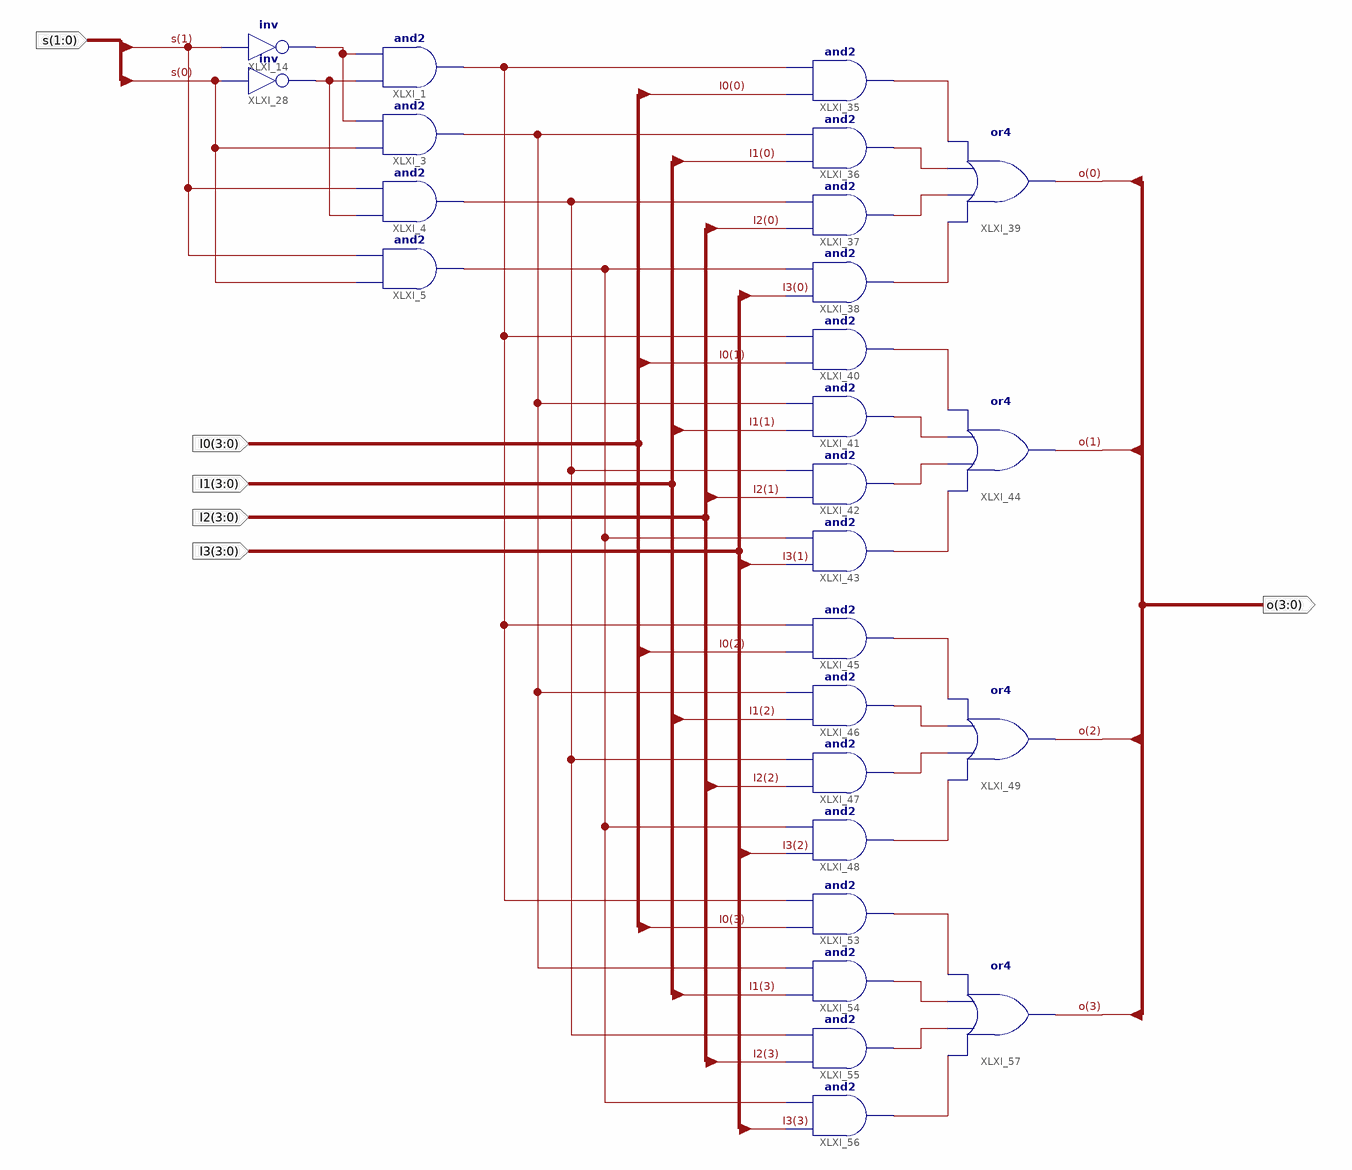
[diagram p0: schematic sheet 1]
// Xilinx ISE schematic MUX4T1_4.sch (kintex7) as structural Verilog: 26 symbols, 6 ports
module MUX4T1_4 (
  input  [1:0] s,
  input  [3:0] I0,
  input  [3:0] I2,
  input  [3:0] I3,
  input  [3:0] I1,
  output [3:0] o
);

  wire XLXN_21, XLXN_22, XLXN_30, XLXN_31, XLXN_32, XLXN_33, XLXN_39, XLXN_40, XLXN_41, XLXN_42, XLXN_43,
       XLXN_44, XLXN_45, XLXN_46, XLXN_47, XLXN_48, XLXN_49, XLXN_50, XLXN_51, XLXN_52, XLXN_53, XLXN_54;

  and XLXI_1 (XLXN_30, XLXN_21, XLXN_22);
  and XLXI_3 (XLXN_31, s[0], XLXN_22);
  and XLXI_4 (XLXN_32, XLXN_21, s[1]);
  and XLXI_5 (XLXN_33, s[0], s[1]);
  not XLXI_14 (XLXN_22, s[1]);
  not XLXI_28 (XLXN_21, s[0]);
  and XLXI_35 (XLXN_39, I0[0], XLXN_30);
  and XLXI_36 (XLXN_40, I1[0], XLXN_31);
  and XLXI_37 (XLXN_41, I2[0], XLXN_32);
  and XLXI_38 (XLXN_42, I3[0], XLXN_33);
  or XLXI_39 (o[0], XLXN_42, XLXN_41, XLXN_40, XLXN_39);
  and XLXI_40 (XLXN_43, I0[1], XLXN_30);
  and XLXI_41 (XLXN_44, I1[1], XLXN_31);
  and XLXI_42 (XLXN_45, I2[1], XLXN_32);
  and XLXI_43 (XLXN_46, I3[1], XLXN_33);
  or XLXI_44 (o[1], XLXN_46, XLXN_45, XLXN_44, XLXN_43);
  and XLXI_45 (XLXN_47, I0[2], XLXN_30);
  and XLXI_46 (XLXN_48, I1[2], XLXN_31);
  and XLXI_47 (XLXN_49, I2[2], XLXN_32);
  and XLXI_48 (XLXN_50, I3[2], XLXN_33);
  or XLXI_49 (o[2], XLXN_50, XLXN_49, XLXN_48, XLXN_47);
  and XLXI_53 (XLXN_51, I0[3], XLXN_30);
  and XLXI_54 (XLXN_52, I1[3], XLXN_31);
  and XLXI_55 (XLXN_53, I2[3], XLXN_32);
  and XLXI_56 (XLXN_54, I3[3], XLXN_33);
  or XLXI_57 (o[3], XLXN_54, XLXN_53, XLXN_52, XLXN_51);
endmodule
